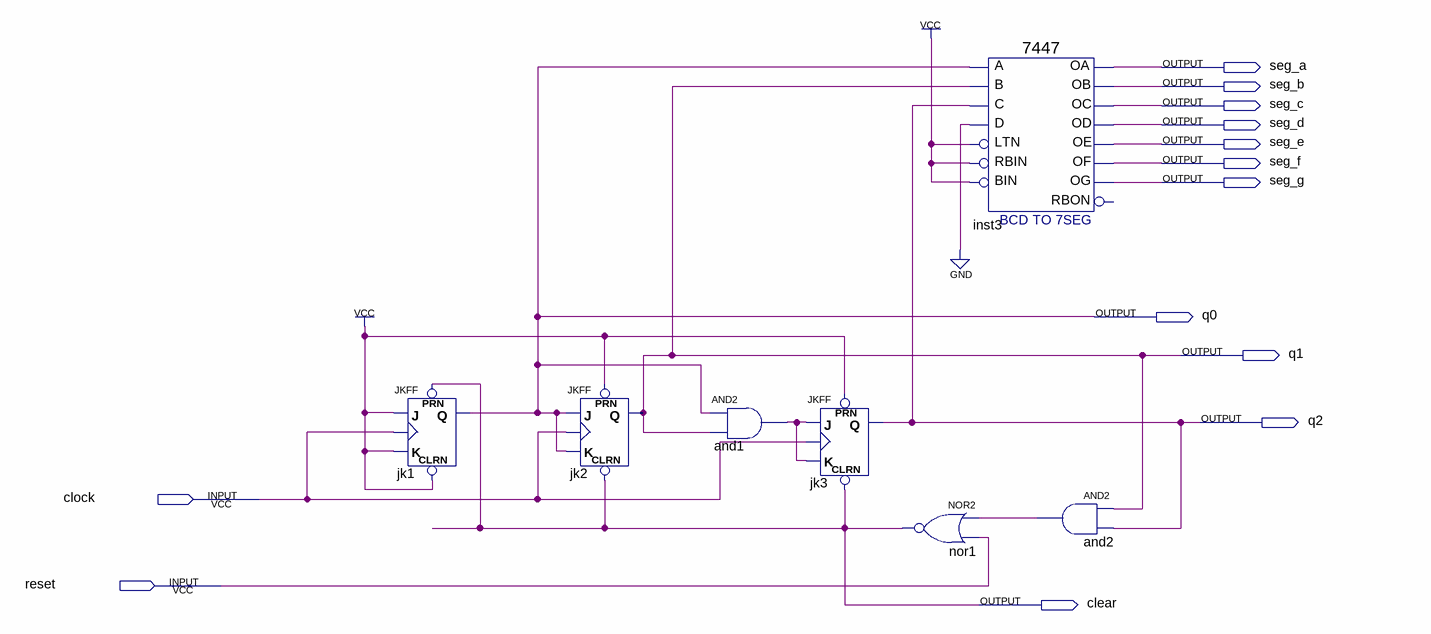
[diagram p0: schematic sheet]
// Quartus schematic Three_Bit_Counter.bdf as structural Verilog: 7 symbols, 13 pins
module Three_Bit_Counter (
  input  clock,
  input  reset,
  output seg_a,
  output seg_b,
  output seg_c,
  output seg_d,
  output seg_e,
  output seg_f,
  output seg_g,
  output q0,
  output q1,
  output q2,
  output clear
);

  wire and1_out, and2_out;

  JKFF jk1 (.PRN(clear), .CLRN(1'b1), .K(1'b1), .J(1'b1), .CLK(clock), .Q(q0));
  JKFF jk2 (.PRN(1'b1), .CLRN(clear), .K(q0), .J(q0), .CLK(clock), .Q(q1));
  and and1 (and1_out, q0, q1);
  JKFF jk3 (.PRN(1'b1), .CLRN(clear), .K(and1_out), .J(and1_out), .CLK(clock), .Q(q2));
  nor nor1 (clear, and2_out, reset);
  \7447  inst3 (
    .LTN(1'b1), .B(q1), .C(q2), .D(1'b0), .RBIN(1'b1), .BIN(1'b1), .A(q0), .OB(seg_b), .OC(seg_c),
    .OE(seg_e), .OD(seg_d), .OF(seg_f), .OG(seg_g), .OA(seg_a));  // open: RBON
  and and2 (and2_out, q1, q2);
endmodule
